# EAGLE design lighting_ctl (EAGLE 9.6.0)

## Sheet 1 of 2
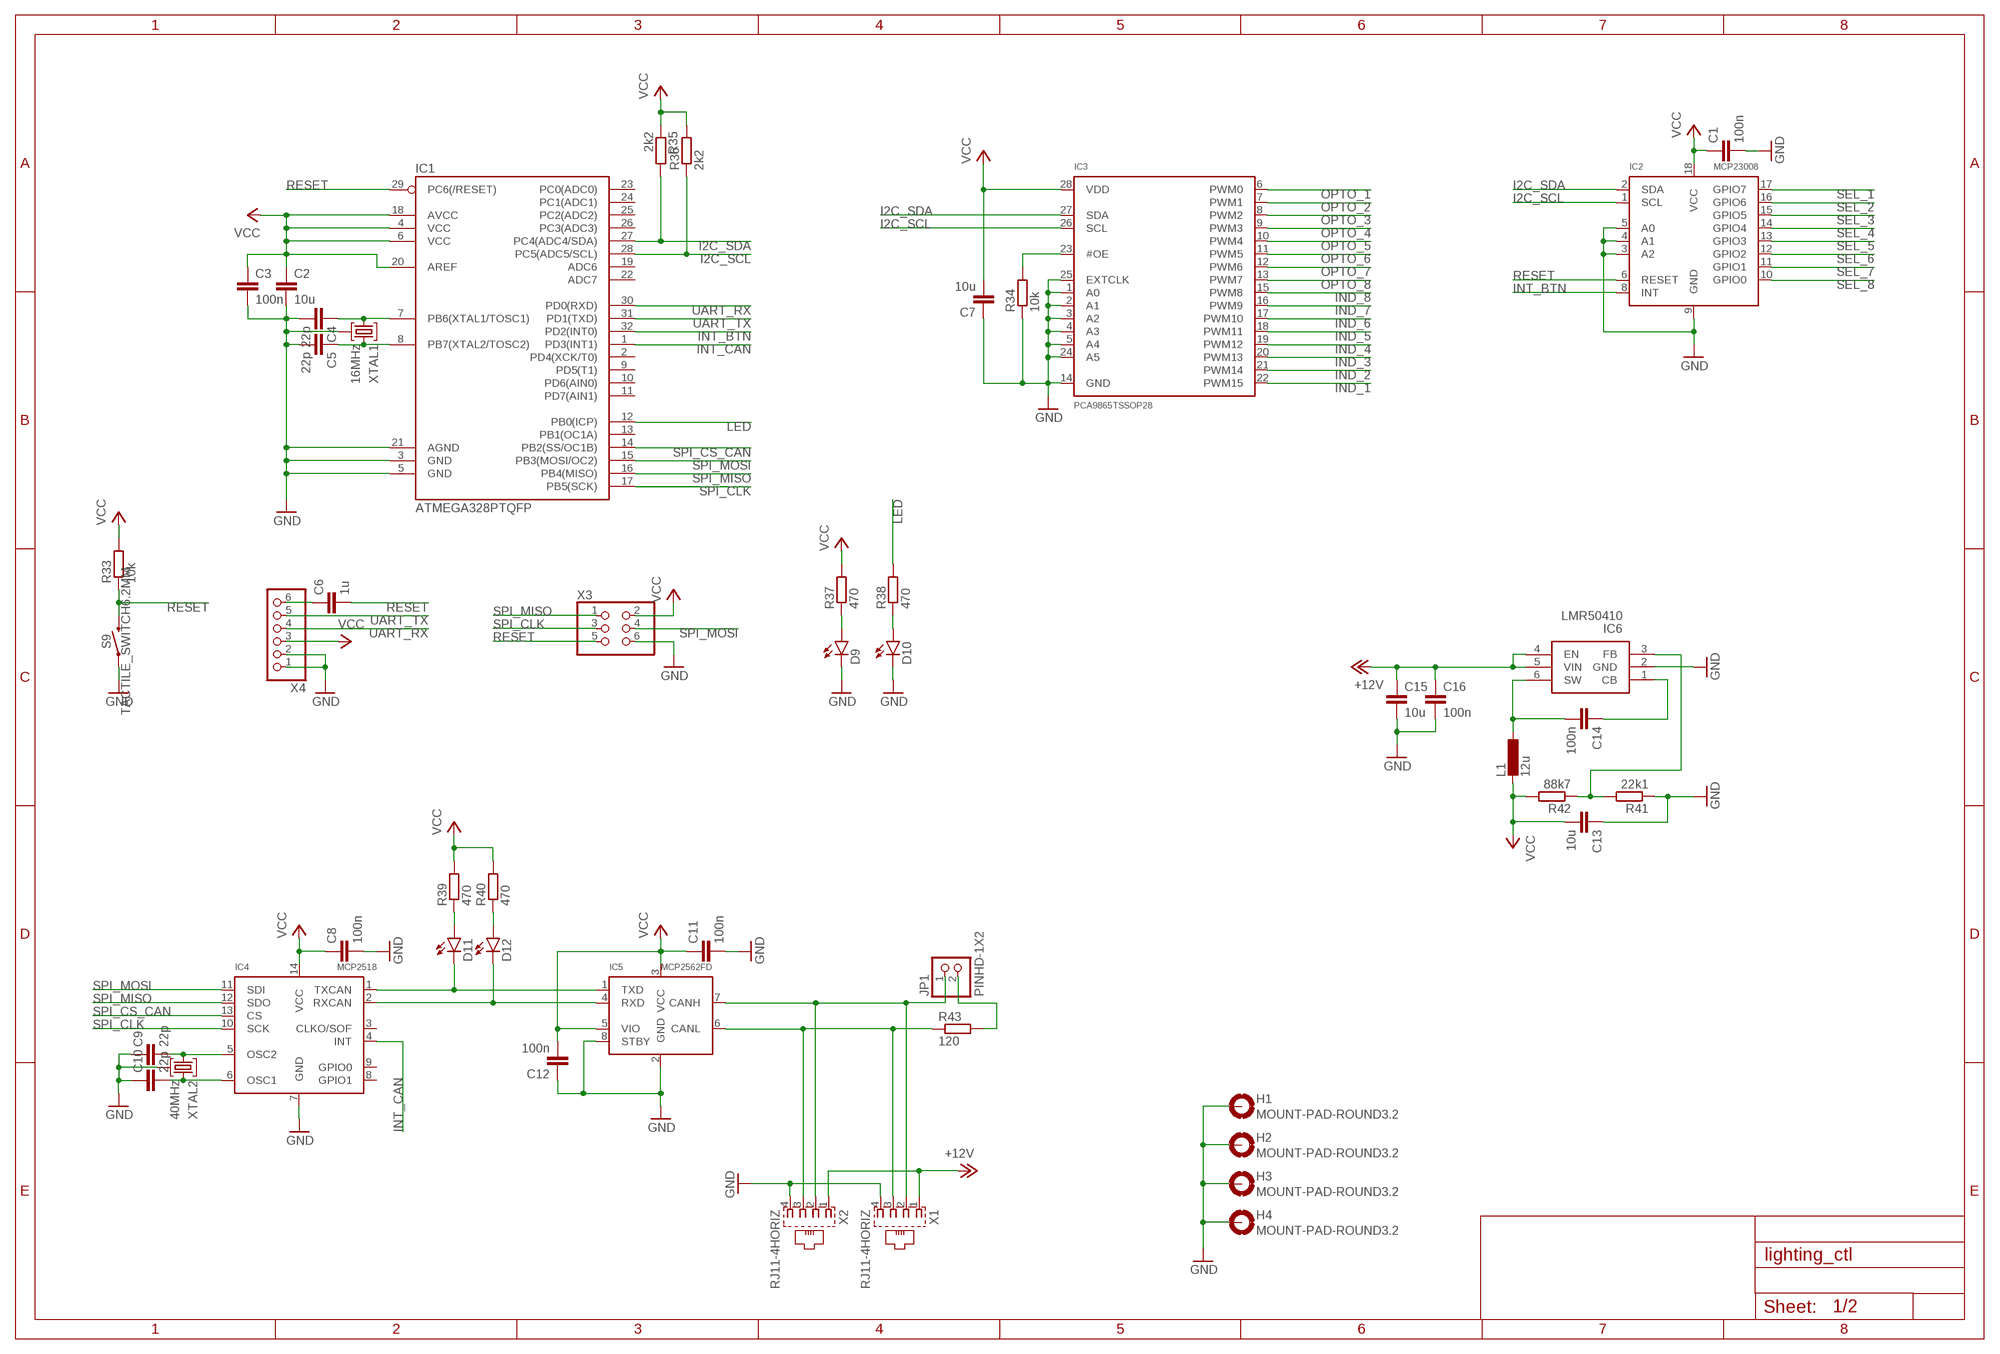
[diagram p0: schematic, sheet 1]

### Parts
C1  100n  CAPACITOR0805  [C0805]
C2  10u  CAPACITOR1206  [C1206]
C3  100n  CAPACITOR0805  [C0805]
C4  22p  CAPACITOR0805  [C0805]
C5  22p  CAPACITOR0805  [C0805]
C6  1u  CAPACITOR0805  [C0805]
C7  10u  CAPACITOR1206  [C1206]
C8  100n  CAPACITOR0805  [C0805]
C9  22p  CAPACITOR0805  [C0805]
C10  22p  CAPACITOR0805  [C0805]
C11  100n  CAPACITOR0805  [C0805]
C12  100n  CAPACITOR0805  [C0805]
C13  10u  CAPACITOR1206  [C1206]
C14  100n  CAPACITOR0805  [C0805]
C15  10u  CAPACITOR1206  [C1206]
C16  100n  CAPACITOR0805  [C0805]
D9  LED1206  [CHIPLED_1206]
D10  LED1206  [CHIPLED_1206]
D11  LED1206  [CHIPLED_1206]
D12  LED1206  [CHIPLED_1206]
H1  MOUNT-PAD-ROUND3.2  [3,2-PAD]
H2  MOUNT-PAD-ROUND3.2  [3,2-PAD]
H3  MOUNT-PAD-ROUND3.2  [3,2-PAD]
H4  MOUNT-PAD-ROUND3.2  [3,2-PAD]
IC1  ATMEGA328PTQFP  [TQFP32_0.8MM_7X7MM]
IC2  MCP23008  MCP23008SO18W  [SO18W]
IC3  PCA9865TSSOP28  [TSSOP28]
IC4  MCP2518  MCP2518FDSO14  [SO14]
IC5  MCP2562FD  MCP2562FDSO08  [SO08]
IC6  LMR50410  [SOT23-6]
JP1  PINHD-1X2  [1X02]
L1  12u  INDUCTOR7.3MM  [L_7.3MM]
R33  10k  RESISTOR0805  [R0805]
R34  10k  RESISTOR0805  [R0805]
R35  2k2  RESISTOR0805  [R0805]
R36  2k2  RESISTOR0805  [R0805]
R37  470  RESISTOR0805  [R0805]
R38  470  RESISTOR0805  [R0805]
R39  470  RESISTOR0805  [R0805]
R40  470  RESISTOR0805  [R0805]
R41  22k1  RESISTOR0805  [R0805]
R42  88k7  RESISTOR0805  [R0805]
R43  120  RESISTOR0805  [R0805]
S9  TACTILE_SWITCH6.2MM  [TACTILE_SWITCH_SMD_6.2MM]
X1  RJ11-4HORIZ  [RJ11-4_HORIZ]
X2  RJ11-4HORIZ  [RJ11-4_HORIZ]
X3  PINHD-2X3  [2X03]
X4  PINHD-1X6  [1X06]
XTAL1  16MHz  CRYSTAL_GND5X3.2  [XTAL_5.0X3.2_4]
XTAL2  40MHz  CRYSTAL_GND5X3.2  [XTAL_5.0X3.2_4]

### Nets
+12V: C15.1 C16.1 IC6.4(EN) IC6.5(VIN) X1.1 X2.1
GND: C1.2 C2.2 C3.2 C4.2 C5.2 C7.1 C8.2 C9.1 C10.1 C11.2 C12.1 C13.1 C15.2 C16.2 D9.C D10.C H1.B3,2(MOUNT) H1.P$1(MOUNT) H1.P$2(MOUNT) H1.P$3(MOUNT) H1.P$4(MOUNT) H1.P$5(MOUNT) H1.P$6(MOUNT) H1.P$7(MOUNT) H1.P$8(MOUNT) H2.B3,2(MOUNT) H2.P$1(MOUNT) H2.P$2(MOUNT) H2.P$3(MOUNT) H2.P$4(MOUNT) H2.P$5(MOUNT) H2.P$6(MOUNT) H2.P$7(MOUNT) H2.P$8(MOUNT) H3.B3,2(MOUNT) H3.P$1(MOUNT) H3.P$2(MOUNT) H3.P$3(MOUNT) H3.P$4(MOUNT) H3.P$5(MOUNT) H3.P$6(MOUNT) H3.P$7(MOUNT) H3.P$8(MOUNT) H4.B3,2(MOUNT) H4.P$1(MOUNT) H4.P$2(MOUNT) H4.P$3(MOUNT) H4.P$4(MOUNT) H4.P$5(MOUNT) H4.P$6(MOUNT) H4.P$7(MOUNT) H4.P$8(MOUNT) IC1.3(GND) IC1.5(GND) IC1.21(AGND) IC2.3(A2) IC2.4(A1) IC2.5(A0) IC2.9(GND) IC3.1(A0) IC3.2(A1) IC3.3(A2) IC3.4(A3) IC3.5(A4) IC3.14(GND) IC3.24(A5) IC3.25(EXTCLK) IC4.7(GND) IC5.2(GND) IC5.8(STBY) IC6.2(GND) R34.1 R41.1 S9.A1 S9.A2 X1.4 X2.4 X3.6 X4.1 X4.2 XTAL1.2 XTAL1.4 XTAL2.2 XTAL2.4 ; also sheet 2
I2C_SCL: IC1.28(PC5(ADC5/SCL)) IC2.1(SCL) IC3.26(SCL) R36.1
I2C_SDA: IC1.27(PC4(ADC4/SDA)) IC2.2(SDA) IC3.27(SDA) R35.2
IND_1: IC3.22(PWM15) ; also sheet 2
IND_2: IC3.21(PWM14) ; also sheet 2
IND_3: IC3.20(PWM13) ; also sheet 2
IND_4: IC3.19(PWM12) ; also sheet 2
IND_5: IC3.18(PWM11) ; also sheet 2
IND_6: IC3.17(PWM10) ; also sheet 2
IND_7: IC3.16(PWM9) ; also sheet 2
IND_8: IC3.15(PWM8) ; also sheet 2
INT_BTN: IC1.32(PD2(INT0)) IC2.8(INT)
INT_CAN: IC1.1(PD3(INT1)) IC4.4(INT)
LED: IC1.12(PB0(ICP)) R38.2
N$1: IC3.23(#OE) R34.2
N$2: D9.A R37.1
N$3: C4.1 IC1.7(PB6(XTAL1/TOSC1)) XTAL1.1
N$4: C5.1 IC1.8(PB7(XTAL2/TOSC2)) XTAL1.3
N$5: D10.A R38.1
N$6: C6.1 X4.6
N$7: C14.2 IC6.6(SW) L1.1
N$8: IC6.3(FB) R41.2 R42.1
N$9: C14.1 IC6.1(CB)
N$16: IC5.6(CANL) R43.1 X1.3 X2.3
N$17: IC5.7(CANH) JP1.1 X1.2 X2.2
N$18: D11.C IC4.1(TXCAN) IC5.1(TXD)
N$19: D12.C IC4.2(RXCAN) IC5.4(RXD)
N$20: C9.2 IC4.5(OSC2) XTAL2.1
N$21: C10.2 IC4.6(OSC1) XTAL2.3
N$22: D11.A R39.1
N$23: D12.A R40.1
N$24: JP1.2 R43.2
OPTO_1: IC3.6(PWM0) ; also sheet 2
OPTO_2: IC3.7(PWM1) ; also sheet 2
OPTO_3: IC3.8(PWM2) ; also sheet 2
OPTO_4: IC3.9(PWM3) ; also sheet 2
OPTO_5: IC3.10(PWM4) ; also sheet 2
OPTO_6: IC3.11(PWM5) ; also sheet 2
OPTO_7: IC3.12(PWM6) ; also sheet 2
OPTO_8: IC3.13(PWM7) ; also sheet 2
RESET: C6.2 IC1.29(PC6(/RESET)) IC2.6(RESET) R33.1 S9.B1 S9.B2 X3.5
SEL_1: IC2.17(GPIO7) ; also sheet 2
SEL_2: IC2.16(GPIO6) ; also sheet 2
SEL_3: IC2.15(GPIO5) ; also sheet 2
SEL_4: IC2.14(GPIO4) ; also sheet 2
SEL_5: IC2.13(GPIO3) ; also sheet 2
SEL_6: IC2.12(GPIO2) ; also sheet 2
SEL_7: IC2.11(GPIO1) ; also sheet 2
SEL_8: IC2.10(GPIO0) ; also sheet 2
SPI_CLK: IC1.17(PB5(SCK)) IC4.10(SCK) X3.3
SPI_CS_CAN: IC1.14(PB2(SS/OC1B)) IC4.13(CS)
SPI_MISO: IC1.16(PB4(MISO)) IC4.12(SDO) X3.1
SPI_MOSI: IC1.15(PB3(MOSI/OC2)) IC4.11(SDI) X3.4
UART_RX: IC1.30(PD0(RXD)) X4.4
UART_TX: IC1.31(PD1(TXD)) X4.5
VCC: C1.1 C2.1 C3.1 C7.2 C8.1 C11.1 C12.2 C13.2 IC1.4(VCC) IC1.6(VCC) IC1.18(AVCC) IC1.20(AREF) IC2.18(VCC) IC3.28(VDD) IC4.14(VCC) IC5.3(VCC) IC5.5(VIO) L1.2 R33.2 R35.1 R36.2 R37.2 R39.2 R40.2 R42.2 X3.2 X4.3
Unconnected: IC1.2(PD4(XCK/T0)) IC1.9(PD5(T1)) IC1.10(PD6(AIN0)) IC1.11(PD7(AIN1)) IC1.13(PB1(OC1A)) IC1.19(ADC6) IC1.22(ADC7) IC1.23(PC0(ADC0)) IC1.24(PC1(ADC1)) IC1.25(PC2(ADC2)) IC1.26(PC3(ADC3)) IC4.3(CLKO/SOF) IC4.8(GPIO1) IC4.9(GPIO0)

## Sheet 2 of 2
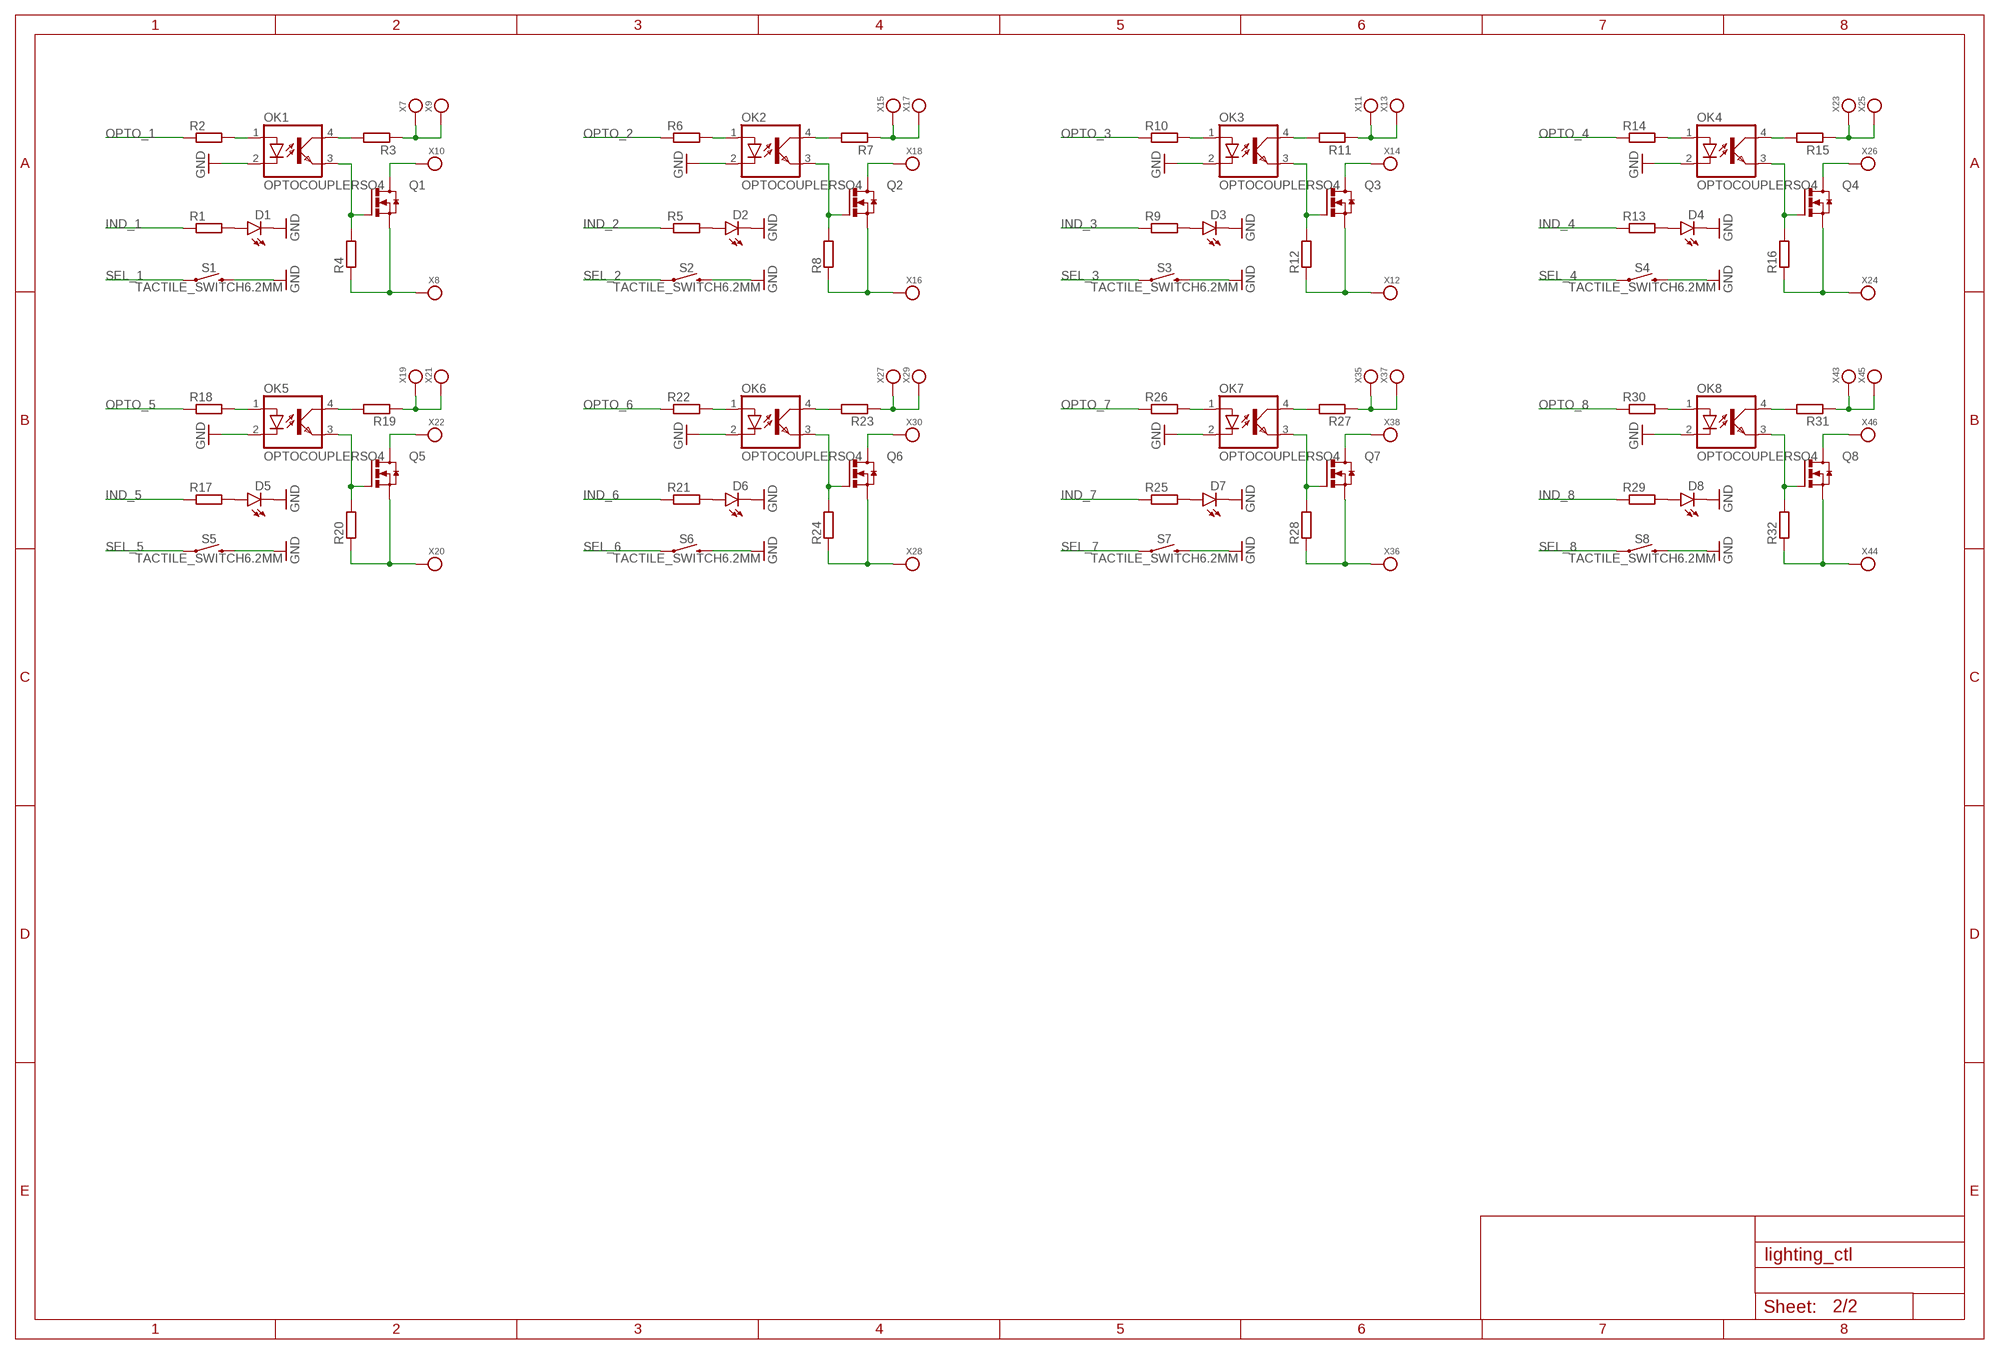
[diagram p1: schematic, sheet 2]

### Parts
D1  LED1206  [CHIPLED_1206]
D2  LED1206  [CHIPLED_1206]
D3  LED1206  [CHIPLED_1206]
D4  LED1206  [CHIPLED_1206]
D5  LED1206  [CHIPLED_1206]
D6  LED1206  [CHIPLED_1206]
D7  LED1206  [CHIPLED_1206]
D8  LED1206  [CHIPLED_1206]
OK1  OPTOCOUPLERSO4  [SO04]
OK2  OPTOCOUPLERSO4  [SO04]
OK3  OPTOCOUPLERSO4  [SO04]
OK4  OPTOCOUPLERSO4  [SO04]
OK5  OPTOCOUPLERSO4  [SO04]
OK6  OPTOCOUPLERSO4  [SO04]
OK7  OPTOCOUPLERSO4  [SO04]
OK8  OPTOCOUPLERSO4  [SO04]
Q1  MOSFET_N_CHANNELSOT223  [SOT223]
Q2  MOSFET_N_CHANNELSOT223  [SOT223]
Q3  MOSFET_N_CHANNELSOT223  [SOT223]
Q4  MOSFET_N_CHANNELSOT223  [SOT223]
Q5  MOSFET_N_CHANNELSOT223  [SOT223]
Q6  MOSFET_N_CHANNELSOT223  [SOT223]
Q7  MOSFET_N_CHANNELSOT223  [SOT223]
Q8  MOSFET_N_CHANNELSOT223  [SOT223]
R1  RESISTOR0805  [R0805]
R2  RESISTOR0805  [R0805]
R3  RESISTOR0805  [R0805]
R4  RESISTOR0805  [R0805]
R5  RESISTOR0805  [R0805]
R6  RESISTOR0805  [R0805]
R7  RESISTOR0805  [R0805]
R8  RESISTOR0805  [R0805]
R9  RESISTOR0805  [R0805]
R10  RESISTOR0805  [R0805]
R11  RESISTOR0805  [R0805]
R12  RESISTOR0805  [R0805]
R13  RESISTOR0805  [R0805]
R14  RESISTOR0805  [R0805]
R15  RESISTOR0805  [R0805]
R16  RESISTOR0805  [R0805]
R17  RESISTOR0805  [R0805]
R18  RESISTOR0805  [R0805]
R19  RESISTOR0805  [R0805]
R20  RESISTOR0805  [R0805]
R21  RESISTOR0805  [R0805]
R22  RESISTOR0805  [R0805]
R23  RESISTOR0805  [R0805]
R24  RESISTOR0805  [R0805]
R25  RESISTOR0805  [R0805]
R26  RESISTOR0805  [R0805]
R27  RESISTOR0805  [R0805]
R28  RESISTOR0805  [R0805]
R29  RESISTOR0805  [R0805]
R30  RESISTOR0805  [R0805]
R31  RESISTOR0805  [R0805]
R32  RESISTOR0805  [R0805]
S1  TACTILE_SWITCH6.2MM  [TACTILE_SWITCH_SMD_6.2MM]
S2  TACTILE_SWITCH6.2MM  [TACTILE_SWITCH_SMD_6.2MM]
S3  TACTILE_SWITCH6.2MM  [TACTILE_SWITCH_SMD_6.2MM]
S4  TACTILE_SWITCH6.2MM  [TACTILE_SWITCH_SMD_6.2MM]
S5  TACTILE_SWITCH6.2MM  [TACTILE_SWITCH_SMD_6.2MM]
S6  TACTILE_SWITCH6.2MM  [TACTILE_SWITCH_SMD_6.2MM]
S7  TACTILE_SWITCH6.2MM  [TACTILE_SWITCH_SMD_6.2MM]
S8  TACTILE_SWITCH6.2MM  [TACTILE_SWITCH_SMD_6.2MM]
X7  KEYSTONE_7788  [KEYSTONE_7788]
X8  KEYSTONE_7788  [KEYSTONE_7788]
X9  KEYSTONE_7788  [KEYSTONE_7788]
X10  KEYSTONE_7788  [KEYSTONE_7788]
X11  KEYSTONE_7788  [KEYSTONE_7788]
X12  KEYSTONE_7788  [KEYSTONE_7788]
X13  KEYSTONE_7788  [KEYSTONE_7788]
X14  KEYSTONE_7788  [KEYSTONE_7788]
X15  KEYSTONE_7788  [KEYSTONE_7788]
X16  KEYSTONE_7788  [KEYSTONE_7788]
X17  KEYSTONE_7788  [KEYSTONE_7788]
X18  KEYSTONE_7788  [KEYSTONE_7788]
X19  KEYSTONE_7788  [KEYSTONE_7788]
X20  KEYSTONE_7788  [KEYSTONE_7788]
X21  KEYSTONE_7788  [KEYSTONE_7788]
X22  KEYSTONE_7788  [KEYSTONE_7788]
X23  KEYSTONE_7788  [KEYSTONE_7788]
X24  KEYSTONE_7788  [KEYSTONE_7788]
X25  KEYSTONE_7788  [KEYSTONE_7788]
X26  KEYSTONE_7788  [KEYSTONE_7788]
X27  KEYSTONE_7788  [KEYSTONE_7788]
X28  KEYSTONE_7788  [KEYSTONE_7788]
X29  KEYSTONE_7788  [KEYSTONE_7788]
X30  KEYSTONE_7788  [KEYSTONE_7788]
X35  KEYSTONE_7788  [KEYSTONE_7788]
X36  KEYSTONE_7788  [KEYSTONE_7788]
X37  KEYSTONE_7788  [KEYSTONE_7788]
X38  KEYSTONE_7788  [KEYSTONE_7788]
X43  KEYSTONE_7788  [KEYSTONE_7788]
X44  KEYSTONE_7788  [KEYSTONE_7788]
X45  KEYSTONE_7788  [KEYSTONE_7788]
X46  KEYSTONE_7788  [KEYSTONE_7788]

### Nets
GND: D1.C D2.C D3.C D4.C D5.C D6.C D7.C D8.C OK1.2(C) OK2.2(C) OK3.2(C) OK4.2(C) OK5.2(C) OK6.2(C) OK7.2(C) OK8.2(C) S1.B1 S1.B2 S2.B1 S2.B2 S3.B1 S3.B2 S4.B1 S4.B2 S5.B1 S5.B2 S6.B1 S6.B2 S7.B1 S7.B2 S8.B1 S8.B2 ; also sheet 1
IND_1: R1.1 ; also sheet 1
IND_2: R5.1 ; also sheet 1
IND_3: R9.1 ; also sheet 1
IND_4: R13.1 ; also sheet 1
IND_5: R17.1 ; also sheet 1
IND_6: R21.1 ; also sheet 1
IND_7: R25.1 ; also sheet 1
IND_8: R29.1 ; also sheet 1
N$11: OK1.1(A) R2.2
N$12: D1.A R1.2
N$13: OK1.4(COL) R3.2
N$14: R3.1 X7.1(PIN) X7.2(PIN) X7.3(PIN) X7.4(PIN) X9.1(PIN) X9.2(PIN) X9.3(PIN) X9.4(PIN)
N$15: Q1.2(D) Q1.4(D) X10.1(PIN) X10.2(PIN) X10.3(PIN) X10.4(PIN)
N$25: OK1.3(EMIT) Q1.1(G) R4.2
N$26: Q1.3(S) R4.1 X8.1(PIN) X8.2(PIN) X8.3(PIN) X8.4(PIN)
N$27: OK3.1(A) R10.2
N$28: D3.A R9.2
N$29: OK3.4(COL) R11.2
N$30: R11.1 X11.1(PIN) X11.2(PIN) X11.3(PIN) X11.4(PIN) X13.1(PIN) X13.2(PIN) X13.3(PIN) X13.4(PIN)
N$31: Q3.2(D) Q3.4(D) X14.1(PIN) X14.2(PIN) X14.3(PIN) X14.4(PIN)
N$32: OK3.3(EMIT) Q3.1(G) R12.2
N$33: Q3.3(S) R12.1 X12.1(PIN) X12.2(PIN) X12.3(PIN) X12.4(PIN)
N$34: OK2.1(A) R6.2
N$35: D2.A R5.2
N$36: OK2.4(COL) R7.2
N$37: R7.1 X15.1(PIN) X15.2(PIN) X15.3(PIN) X15.4(PIN) X17.1(PIN) X17.2(PIN) X17.3(PIN) X17.4(PIN)
N$38: Q2.2(D) Q2.4(D) X18.1(PIN) X18.2(PIN) X18.3(PIN) X18.4(PIN)
N$39: OK2.3(EMIT) Q2.1(G) R8.2
N$40: Q2.3(S) R8.1 X16.1(PIN) X16.2(PIN) X16.3(PIN) X16.4(PIN)
N$41: OK5.1(A) R18.2
N$42: D5.A R17.2
N$43: OK5.4(COL) R19.2
N$44: R19.1 X19.1(PIN) X19.2(PIN) X19.3(PIN) X19.4(PIN) X21.1(PIN) X21.2(PIN) X21.3(PIN) X21.4(PIN)
N$45: Q5.2(D) Q5.4(D) X22.1(PIN) X22.2(PIN) X22.3(PIN) X22.4(PIN)
N$46: OK5.3(EMIT) Q5.1(G) R20.2
N$47: Q5.3(S) R20.1 X20.1(PIN) X20.2(PIN) X20.3(PIN) X20.4(PIN)
N$48: OK4.1(A) R14.2
N$49: D4.A R13.2
N$50: OK4.4(COL) R15.2
N$51: R15.1 X23.1(PIN) X23.2(PIN) X23.3(PIN) X23.4(PIN) X25.1(PIN) X25.2(PIN) X25.3(PIN) X25.4(PIN)
N$52: Q4.2(D) Q4.4(D) X26.1(PIN) X26.2(PIN) X26.3(PIN) X26.4(PIN)
N$53: OK4.3(EMIT) Q4.1(G) R16.2
N$54: Q4.3(S) R16.1 X24.1(PIN) X24.2(PIN) X24.3(PIN) X24.4(PIN)
N$55: OK6.1(A) R22.2
N$56: D6.A R21.2
N$57: OK6.4(COL) R23.2
N$58: R23.1 X27.1(PIN) X27.2(PIN) X27.3(PIN) X27.4(PIN) X29.1(PIN) X29.2(PIN) X29.3(PIN) X29.4(PIN)
N$59: Q6.2(D) Q6.4(D) X30.1(PIN) X30.2(PIN) X30.3(PIN) X30.4(PIN)
N$60: OK6.3(EMIT) Q6.1(G) R24.2
N$61: Q6.3(S) R24.1 X28.1(PIN) X28.2(PIN) X28.3(PIN) X28.4(PIN)
N$69: OK7.1(A) R26.2
N$70: D7.A R25.2
N$71: OK7.4(COL) R27.2
N$72: R27.1 X35.1(PIN) X35.2(PIN) X35.3(PIN) X35.4(PIN) X37.1(PIN) X37.2(PIN) X37.3(PIN) X37.4(PIN)
N$73: Q7.2(D) Q7.4(D) X38.1(PIN) X38.2(PIN) X38.3(PIN) X38.4(PIN)
N$74: OK7.3(EMIT) Q7.1(G) R28.2
N$75: Q7.3(S) R28.1 X36.1(PIN) X36.2(PIN) X36.3(PIN) X36.4(PIN)
N$83: OK8.1(A) R30.2
N$84: D8.A R29.2
N$85: OK8.4(COL) R31.2
N$86: R31.1 X43.1(PIN) X43.2(PIN) X43.3(PIN) X43.4(PIN) X45.1(PIN) X45.2(PIN) X45.3(PIN) X45.4(PIN)
N$87: Q8.2(D) Q8.4(D) X46.1(PIN) X46.2(PIN) X46.3(PIN) X46.4(PIN)
N$88: OK8.3(EMIT) Q8.1(G) R32.2
N$89: Q8.3(S) R32.1 X44.1(PIN) X44.2(PIN) X44.3(PIN) X44.4(PIN)
OPTO_1: R2.1 ; also sheet 1
OPTO_2: R6.1 ; also sheet 1
OPTO_3: R10.1 ; also sheet 1
OPTO_4: R14.1 ; also sheet 1
OPTO_5: R18.1 ; also sheet 1
OPTO_6: R22.1 ; also sheet 1
OPTO_7: R26.1 ; also sheet 1
OPTO_8: R30.1 ; also sheet 1
SEL_1: S1.A1 S1.A2 ; also sheet 1
SEL_2: S2.A1 S2.A2 ; also sheet 1
SEL_3: S3.A1 S3.A2 ; also sheet 1
SEL_4: S4.A1 S4.A2 ; also sheet 1
SEL_5: S5.A1 S5.A2 ; also sheet 1
SEL_6: S6.A1 S6.A2 ; also sheet 1
SEL_7: S7.A1 S7.A2 ; also sheet 1
SEL_8: S8.A1 S8.A2 ; also sheet 1

## Library data of the parts
C1-C16 = SMD:CAPACITOR
D1-D12 = SMD:LED
H1-H4 = THT:MOUNT-PAD-ROUND: MOUNTING PAD, round
IC1 = SMD:ATMEGA328P
IC2 = SMD:MCP23008
IC3 = SMD:PCA9865
IC4 = SMD:MCP2518FD
IC5 = SMD:MCP2562FD
IC6 = SMD:LMR50410
JP1 = THT:PINHD-1X2: PIN HEADER
L1 = SMD:INDUCTOR
OK1-OK8 = SMD:OPTOCOUPLER
Q1-Q8 = SMD:MOSFET_N_CHANNEL
R1-R43 = SMD:RESISTOR
S1-S9 = SMD:TACTILE_SWITCH
X1 X2 = THT:RJ11-4
X3 = THT:PINHD-2X3: PIN HEADER
X4 = THT:PINHD-1X6: PIN HEADER
X7-X30 X35-X38 X43-X46 = THT:KEYSTONE_7788
XTAL1 XTAL2 = SMD:CRYSTAL_GND

## Board
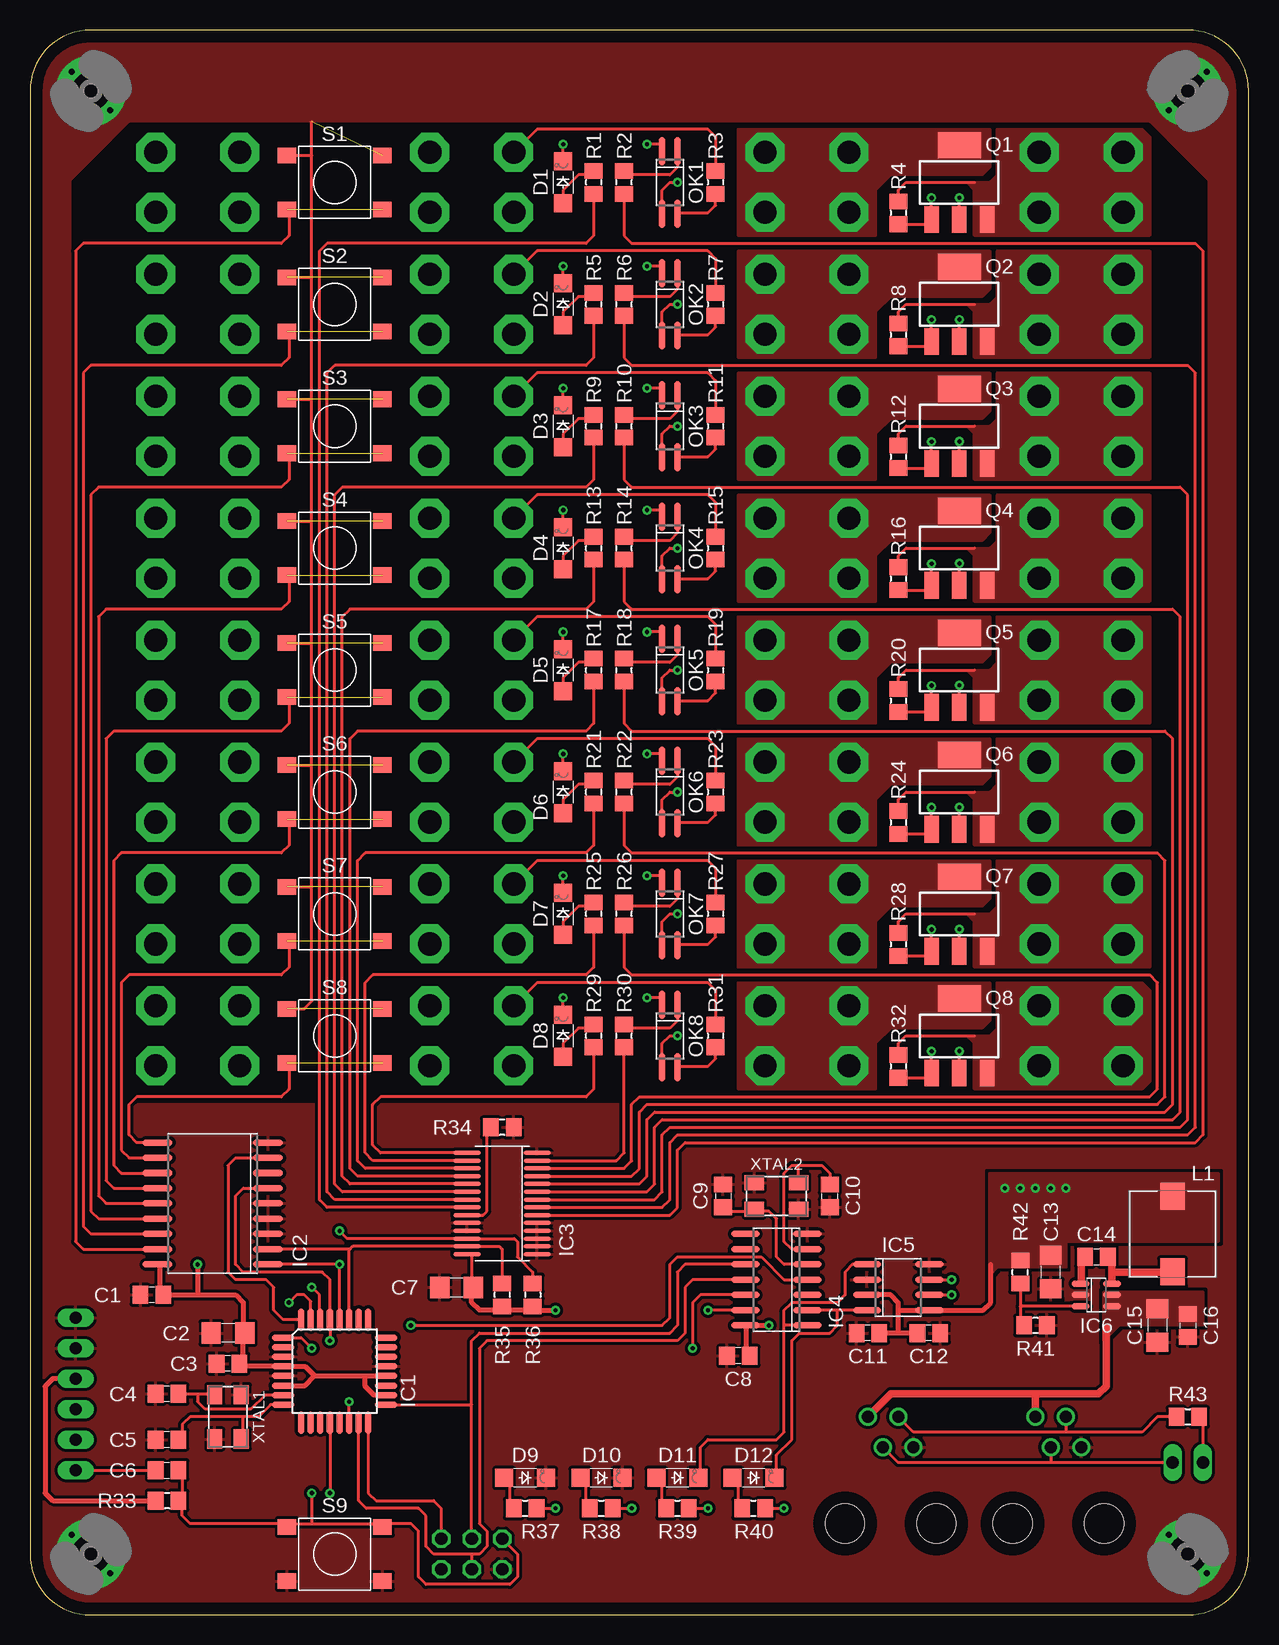
[diagram p2: board, top side]
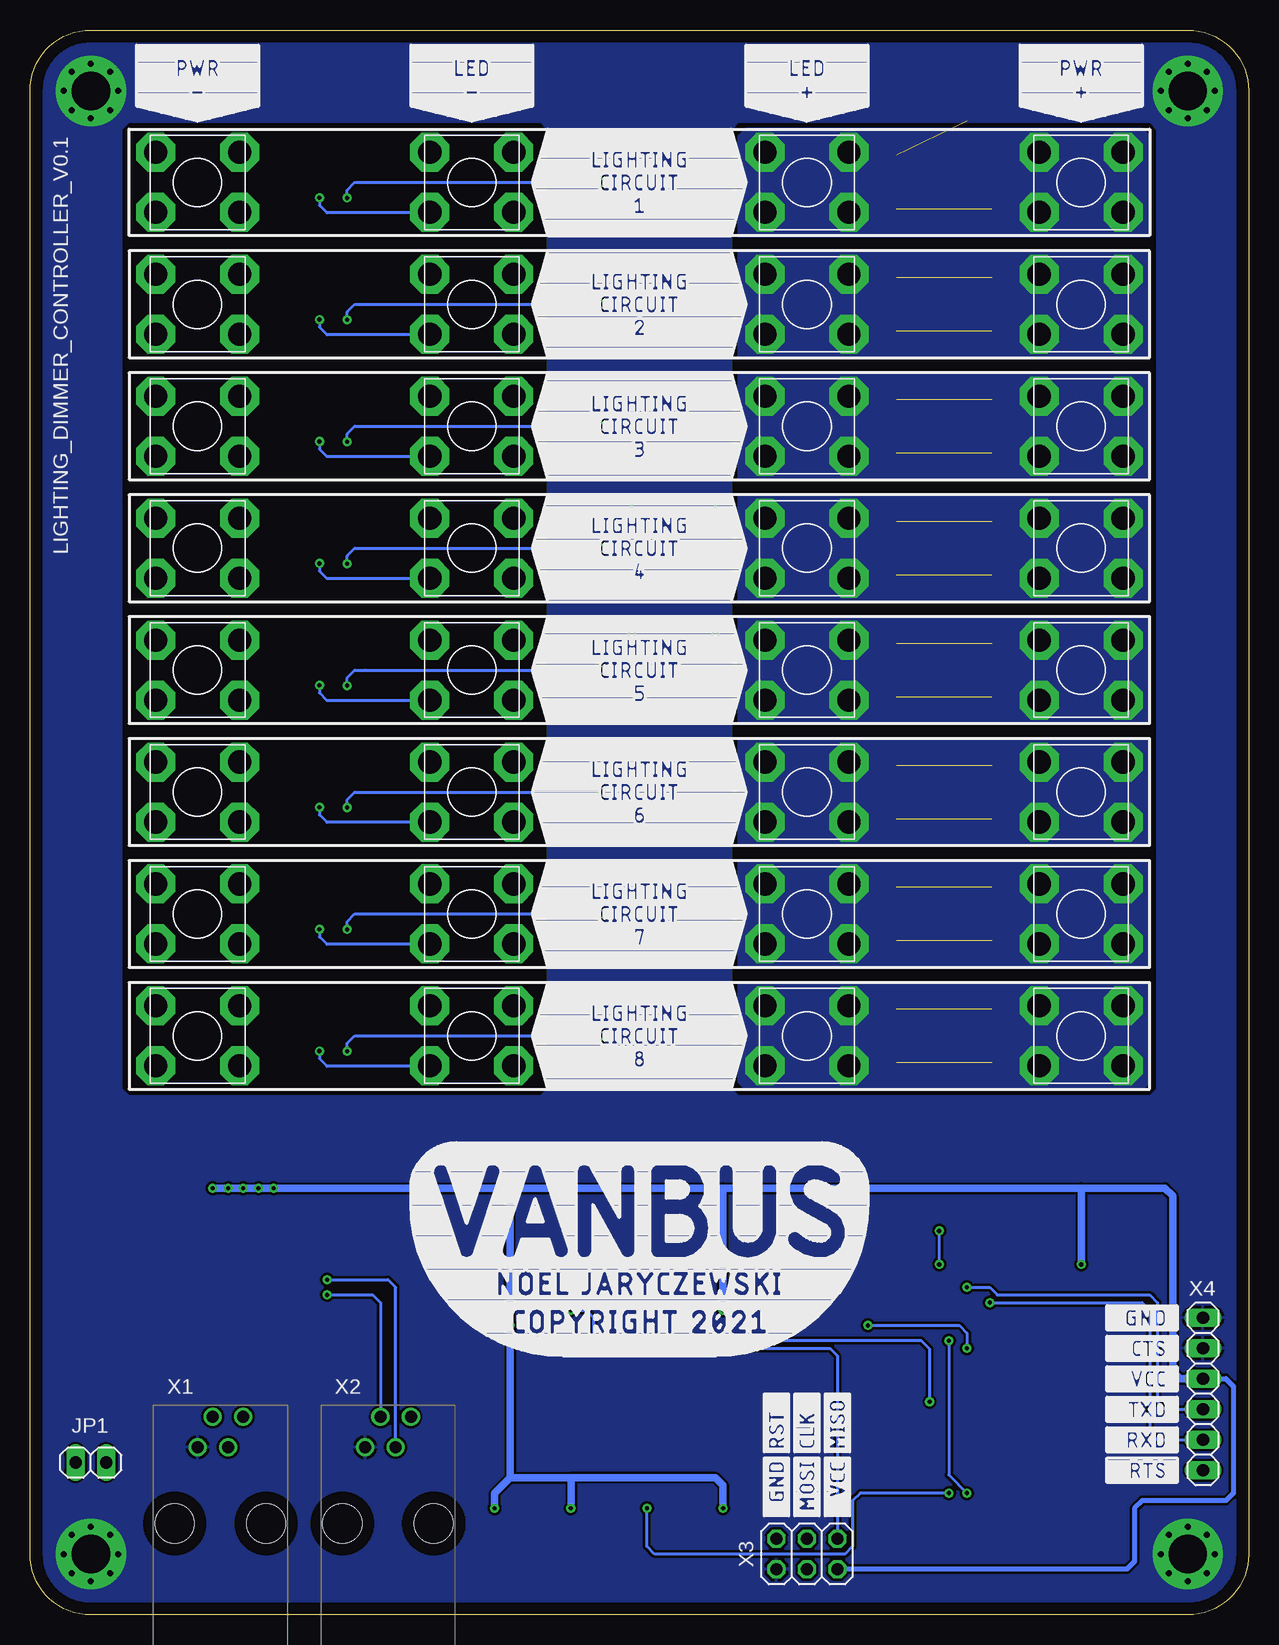
[diagram p3: board, bottom side, seen from below]

Size 101.6 x 132.08 mm. Coordinates in mm from the lower left corner, seen from the top.
Outline: 5.08,0 96.52,0 arc90 101.6,5.08 101.6,127 arc90 96.52,132.08 5.08,132.08 arc90 0,127 0,5.08 arc90 5.08,0
Copper layers (1*16): Top 0.035mm / dielectric 1.5mm / Bottom 0.035mm
Design rules "default *": minimum track width 6mil, minimum drill 0.35mm, track to track 8mil, track to pad 8mil, pad to pad 8mil, via to via 8mil, smd to smd 8mil, copper to edge 40mil, drill to drill 6mil, minimum pad ring 10mil, minimum via ring 8mil, stop-mask expansion 4mil, vias tented up to drill 16mil, thermal gap 10mil

### Footprints (pad centres in the part's own frame; a part is rotated, then mirrored left to right if it is on the bottom)
C0805 = smd 1.3 x 1.5: 1 -0.95,0; 2 0.95,0
C1206 = smd 1.6 x 1.8: 1 -1.4,0; 2 1.4,0
CHIPLED_1206 = smd 1.5 x 1.5: A 0,-1.75; C 0,1.75
3,2-PAD = drill 3.2 pad 5.842: B3,2 0,0 | drill 0.5: P$1 0,2.261; P$2 0,-2.261; P$3 2.261,0; P$4 -2.261,0; P$5 -1.598,1.598; P$6 1.598,1.598; P$7 -1.598,-1.598; P$8 1.598,-1.598
TQFP32_0.8MM_7X7MM = smd 1.905 x 0.559: 1 -4.293,2.8; 2 -4.293,2; 3 -4.293,1.2; 4 -4.293,0.4; 5 -4.293,-0.4; 6 -4.293,-1.2; 7 -4.293,-2; 8 -4.293,-2.8; 17 4.293,-2.8; 18 4.293,-2; 19 4.293,-1.2; 20 4.293,-0.4; 21 4.293,0.4; 22 4.293,1.2; 23 4.293,2; 24 4.293,2.8 | smd 0.559 x 1.905: 9 -2.8,-4.293; 10 -2,-4.293; 11 -1.2,-4.293; 12 -0.4,-4.293; 13 0.4,-4.293; 14 1.2,-4.293; 15 2,-4.293; 16 2.8,-4.293; 25 2.8,4.293; 26 2,4.293; 27 1.2,4.293; 28 0.4,4.293; 29 -0.4,4.293; 30 -1.2,4.293; 31 -2,4.293; 32 -2.8,4.293
SO18W = smd 0.559 x 2.515: 1 -5.08,-4.6; 2 -3.81,-4.6; 3 -2.54,-4.6; 4 -1.27,-4.6; 5 0,-4.6; 6 1.27,-4.6; 7 2.54,-4.6; 8 3.81,-4.6; 9 5.08,-4.6; 10 5.08,4.6; 11 3.81,4.6; 12 2.54,4.6; 13 1.27,4.6; 14 0,4.6; 15 -1.27,4.6; 16 -2.54,4.6; 17 -3.81,4.6; 18 -5.08,4.6
TSSOP28 = smd 0.356 x 2.261: 1 -4.225,-2.918; 2 -3.575,-2.918; 3 -2.925,-2.918; 4 -2.275,-2.918; 5 -1.625,-2.918; 6 -0.975,-2.918; 7 -0.325,-2.918; 8 0.325,-2.918; 9 0.975,-2.918; 10 1.625,-2.918; 11 2.275,-2.918; 12 2.925,-2.918; 13 3.575,-2.918; 14 4.225,-2.918; 15 4.225,2.918; 16 3.575,2.918; 17 2.925,2.918; 18 2.275,2.918; 19 1.625,2.918; 20 0.975,2.918; 21 0.325,2.918; 22 -0.325,2.918; 23 -0.975,2.918; 24 -1.625,2.918; 25 -2.275,2.918; 26 -2.925,2.918; 27 -3.575,2.918; 28 -4.225,2.918
SO14 = smd 0.559 x 2.388: 1 -3.81,-2.6; 2 -2.54,-2.6; 3 -1.27,-2.6; 4 0,-2.6; 5 1.27,-2.6; 6 2.54,-2.6; 7 3.81,-2.6; 8 3.81,2.6; 9 2.54,2.6; 10 1.27,2.6; 11 0,2.6; 12 -1.27,2.6; 13 -2.54,2.6; 14 -3.81,2.6
SO08 = smd 0.559 x 2.388: 1 -1.905,-2.6; 2 -0.635,-2.6; 3 0.635,-2.6; 4 1.905,-2.6; 5 1.905,2.6; 6 0.635,2.6; 7 -0.635,2.6; 8 -1.905,2.6
SOT23-6 = smd 0.559 x 1.524: 1 0.95,1.3; 2 0,1.3; 3 -0.95,1.3; 4 -0.95,-1.3; 5 0,-1.3; 6 0.95,-1.3
1X02 = drill 1.016 long: 1 -1.27,0; 2 1.27,0
L_7.3MM = smd 2.25 x 2.05: 1 -3.15,0; 2 3.15,0
SO04 = smd 0.559 x 2.388: 1 -0.635,-2.6; 2 0.635,-2.6; 3 0.635,2.6; 4 -0.635,2.6
SOT223 = smd 1.219 x 2.235: 1 -2.311,-3.099; 2 0,-3.099; 3 2.311,-3.099 | smd 3.6 x 2.2: 4 0,3.099
R0805 = smd 1.3 x 1.5: 1 -0.95,0; 2 0.95,0
TACTILE_SWITCH_SMD_6.2MM = smd 1.55 x 1.3: A1 -3.975,-2.25; A2 3.975,-2.25; B1 -3.975,2.25; B2 3.975,2.25
RJ11-4_HORIZ = drill 1: 1 -1.905,-8.89; 2 -0.635,-6.35; 3 0.635,-8.89; 4 1.905,-6.35 | hole 3.25: -3.81,0; 3.81,0
2X03 = drill 1.016 octagon: 1 -2.54,-1.27; 2 -2.54,1.27; 3 0,-1.27; 4 0,1.27; 5 2.54,-1.27; 6 2.54,1.27
1X06 = drill 1.016 long: 1 -6.35,0; 2 -3.81,0; 3 -1.27,0; 4 1.27,0; 5 3.81,0; 6 6.35,0
KEYSTONE_7788 = drill 1.93 pad 3.25 octagon: 1 -3.5,2.5; 2 -3.5,-2.5; 3 3.5,-2.5; 4 3.5,2.5
XTAL_5.0X3.2_4 = smd 1.6 x 1.25: 1 -1.85,-1.1; 2 1.85,-1.1; 3 1.85,1.1; 4 -1.85,1.1

### Placement (x,y rotation side)
C1  10.16,26.67 180 top
C2  16.51,23.5 180 top
C3  16.51,20.95 180 top
C4  11.43,18.41 180 top
C5  11.43,14.61 180 top
C6  11.43,12.06 0 top
C7  35.56,27.3 0 top
C8  59.05,21.59 180 top
C9  57.78,34.92 270 top
C10  66.67,34.92 90 top
C11  69.85,23.5 180 top
C12  74.93,23.5 180 top
C13  85.09,28.57 90 top
C14  88.9,29.84 0 top
C15  93.98,24.13 270 top
C16  96.52,24.13 270 top
D1  44.45,119.38 0 top
D2  44.45,109.22 0 top
D3  44.45,99.06 0 top
D4  44.45,88.9 0 top
D5  44.45,78.74 0 top
D6  44.45,68.58 0 top
D7  44.45,58.42 0 top
D8  44.45,48.26 0 top
D9  41.27,11.43 270 top
D10  47.62,11.43 270 top
D11  53.98,11.43 270 top
D12  60.33,11.43 270 top
H1  5.08,5.08 0 top
H2  96.52,5.08 0 top
H3  96.52,127 90 top
H4  5.08,127 0 top
IC1  25.4,20.32 0 top
IC2  15.24,34.29 90 top
IC3  39.37,34.29 90 top
IC4  62.23,27.94 90 top
IC5  72.39,27.3 270 top
IC6  88.9,26.67 90 top
JP1  96.52,12.7 180 bottom
L1  95.25,31.75 90 top
OK1  53.34,119.38 180 top
OK2  53.34,109.22 180 top
OK3  53.34,99.06 180 top
OK4  53.34,88.9 180 top
OK5  53.34,78.74 180 top
OK6  53.34,68.58 180 top
OK7  53.34,58.42 180 top
OK8  53.34,48.26 180 top
Q1  77.47,119.38 0 top
Q2  77.47,109.22 0 top
Q3  77.47,99.06 0 top
Q4  77.47,88.9 0 top
Q5  77.47,78.74 0 top
Q6  77.47,68.58 0 top
Q7  77.47,58.42 0 top
Q8  77.47,48.26 0 top
R1  46.99,119.38 90 top
R2  49.53,119.38 90 top
R3  57.15,119.38 270 top
R4  72.39,116.84 270 top
R5  46.99,109.22 90 top
R6  49.53,109.22 90 top
R7  57.15,109.22 270 top
R8  72.39,106.68 270 top
R9  46.99,99.06 90 top
R10  49.53,99.06 90 top
R11  57.15,99.06 270 top
R12  72.39,96.52 270 top
R13  46.99,88.9 90 top
R14  49.53,88.9 90 top
R15  57.15,88.9 270 top
R16  72.39,86.36 270 top
R17  46.99,78.74 90 top
R18  49.53,78.74 90 top
R19  57.15,78.74 270 top
R20  72.39,76.2 270 top
R21  46.99,68.58 90 top
R22  49.53,68.58 90 top
R23  57.15,68.58 270 top
R24  72.39,66.04 270 top
R25  46.99,58.42 90 top
R26  49.53,58.42 90 top
R27  57.15,58.42 270 top
R28  72.39,55.88 270 top
R29  46.99,48.26 90 top
R30  49.53,48.26 90 top
R31  57.15,48.26 270 top
R32  72.39,45.72 270 top
R33  11.43,9.53 180 top
R34  39.37,40.64 180 top
R35  39.37,26.67 90 top
R36  41.91,26.67 270 top
R37  41.27,8.89 0 top
R38  47.62,8.89 0 top
R39  53.98,8.89 0 top
R40  60.33,8.89 0 top
R41  83.82,24.13 180 top
R42  82.55,28.57 90 top
R43  96.52,16.51 0 top
S1  25.4,119.38 0 top
S2  25.4,109.22 0 top
S3  25.4,99.06 0 top
S4  25.4,88.9 0 top
S5  25.4,78.74 0 top
S6  25.4,68.58 0 top
S7  25.4,58.42 0 top
S8  25.4,48.26 0 top
S9  25.4,5.08 0 top
X1  85.72,7.62 180 bottom
X2  71.75,7.62 180 bottom
X3  36.83,5.08 180 bottom
X4  3.81,18.41 270 bottom
X7  13.97,119.38 0 bottom
X8  87.63,119.38 180 bottom
X9  36.83,119.38 0 bottom
X10  64.77,119.38 0 bottom
X11  13.97,99.06 0 bottom
X12  87.63,99.06 180 bottom
X13  36.83,99.06 0 bottom
X14  64.77,99.06 0 bottom
X15  13.97,109.22 0 bottom
X16  87.63,109.22 180 bottom
X17  36.83,109.22 0 bottom
X18  64.77,109.22 0 bottom
X19  13.97,78.74 0 bottom
X20  87.63,78.74 180 bottom
X21  36.83,78.74 0 bottom
X22  64.77,78.74 0 bottom
X23  13.97,88.9 0 bottom
X24  87.63,88.9 180 bottom
X25  36.83,88.9 0 bottom
X26  64.77,88.9 0 bottom
X27  13.97,68.58 0 bottom
X28  87.63,68.58 180 bottom
X29  36.83,68.58 0 bottom
X30  64.77,68.58 0 bottom
X35  13.97,58.42 0 bottom
X36  87.63,58.42 180 bottom
X37  36.83,58.42 0 bottom
X38  64.77,58.42 0 bottom
X43  13.97,48.26 0 bottom
X44  87.63,48.26 180 bottom
X45  36.83,48.26 0 bottom
X46  64.77,48.26 0 bottom
XTAL1  16.51,16.51 270 top
XTAL2  62.23,34.92 0 top

### Tracks (layer width: path | path; a pad name or v marks a point on that pad's centre or on a via)
+12V
  Top 0.61: 83.82,18.41 71.75,18.41 X2.1 | 83.82,18.41 89.08,18.41 89.71,19.05 89.71,23.95 | X1.1 83.82,18.41
  pour Top (no thermals): 89.53,26.92 97.79,26.92 97.79,24.13 90.81,24.13 89.53,22.86
GND  (via drill 0.35)  (8 unrouted)
  Top 0.254: D1.C v44.45,122.56 | OK1.2 52.7,122.56 v51.44,122.56 | D2.C v44.45,112.39 | OK2.2 52.7,112.39 v51.44,112.39 | D3.C v44.45,102.23 | OK3.2 52.7,102.23 v51.44,102.23 | D4.C v44.45,92.08 | OK4.2 52.7,92.08 v51.44,92.08 | D5.C v44.45,81.92 | OK5.2 52.7,81.92 v51.44,81.92 | D6.C v44.45,71.75 | OK6.2 52.7,71.75 v51.44,71.75 | D7.C v44.45,61.59 | OK7.2 52.7,61.59 v51.44,61.59 | D8.C v44.45,51.44 | OK8.2 52.7,51.44 v51.44,51.44 | S8.B1 22.86,50.51 23.5,51.15 23.5,60.67 | 23.5,60.67 23.5,70.83 | 23.5,70.83 23.5,80.99 | 23.5,80.99 23.5,91.15 | 23.5,91.15 23.5,101.31 | 23.5,101.31 23.5,111.47 | 23.5,111.47 23.5,121.63 | 23.5,121.63 23.5,124.46 | S1.B1 23.5,121.63 | S2.B1 23.5,111.47 | S3.B1 23.5,101.31 | S4.B1 23.5,91.15 | S5.B1 23.5,80.99 | S6.B1 23.5,70.83 | S7.B1 23.5,60.67
  pour Top (isolate 0.254, rank 2): 95.89,0.64 5.71,0.64 arc-90 0.64,5.71 0.64,42.55 100.97,42.55 100.97,5.71 arc-90
  pour Top (isolate 0.254): 0.64,42.55 0.64,126.36 arc-90 5.71,131.44 95.89,131.44 arc-90 100.97,126.36 100.97,42.55 98.3,42.55 98.3,119.51 93.34,124.46 8.26,124.46 3.3,119.51 3.3,42.55
  pour Bottom (isolate 0.254): 0.64,43.81 0.64,126.36 arc-90 5.71,131.44 95.89,131.44 arc-90 100.97,126.36 100.97,43.81 93.98,43.81 93.98,123.83 93.34,124.46 59.05,124.46 58.42,123.83 58.42,43.18 43.18,43.18 43.18,123.83 42.55,124.46 8.26,124.46 7.62,123.83 7.62,43.81
  pour Bottom: 7.62,43.81 8.26,43.18 42.55,43.18 43.18,43.81 58.42,43.81 59.05,43.18 93.34,43.18 93.98,43.81 100.97,43.81 100.97,5.71 arc-90 95.89,0.64 5.71,0.64 arc-90 0.64,5.71 0.64,43.81
  pour Top (no thermals): 88.9,27.05 86.36,27.05 86.36,26.29 88.9,26.29
I2C_SCL  (via drill 0.35)
  Top 0.254: IC1.28 v25.8,29.21 IC2.1 | R36.1 41.91,28.57 40.64,29.84 40.64,31.11 40.39,31.36 IC3.26 26.43,31.36 v25.8,32
  Bottom 0.254: v25.8,29.21 v25.8,32
I2C_SDA
  Top 0.254: IC1.27 26.6,30.41 | IC2.2 26.6,30.48 26.6,30.41 | 26.6,30.41 26.91,30.71 IC3.27 39.13,30.71 39.37,30.48 R35.2
IND_1
  Top 0.254: R1.1 46.99,114.94 46.35,114.3 24.77,114.3 24.13,113.67 24.13,34.6 24.77,33.97 IC3.22
IND_2
  Top 0.254: R5.1 46.99,104.78 46.35,104.14 25.4,104.14 24.77,103.5 24.77,35.25 25.4,34.62 IC3.21
IND_3
  Top 0.254: R9.1 46.99,94.61 46.35,93.98 26.04,93.98 25.4,93.34 25.4,35.9 26.04,35.27 IC3.20
IND_4
  Top 0.254: R13.1 46.99,84.45 46.35,83.82 26.67,83.82 26.04,83.19 26.04,36.55 26.67,35.91 IC3.19
IND_5
  Top 0.254: R17.1 46.99,74.3 46.35,73.66 27.3,73.66 26.67,73.03 26.67,37.2 27.3,36.56 IC3.18
IND_6
  Top 0.254: R21.1 46.99,64.14 46.35,63.5 27.94,63.5 27.3,62.87 27.3,37.85 27.94,37.22 IC3.17
IND_7
  Top 0.254: R25.1 46.99,53.98 46.35,53.34 28.57,53.34 27.94,52.7 27.94,38.5 28.57,37.87 IC3.16
IND_8
  Top 0.254: R29.1 46.99,43.81 46.35,43.18 29.21,43.18 28.57,42.55 28.57,39.15 29.21,38.52 IC3.15
INT_BTN
  Top 0.254: IC2.8 17.14,38.1 16.51,37.47 16.51,28.57 17.14,27.94 19.68,27.94 20.32,27.3 20.32,25.4 21.11,24.61 IC1.32
INT_CAN  (via drill 0.35)
  Top 0.254: v31.75,24.13 52.7,24.13 53.34,24.77 53.34,29.21 53.98,29.84 60.96,29.84 62.87,27.94 IC4.4 | IC1.1 22.6,23.12 v23.5,22.23
  Bottom 0.254: v31.75,24.13 24.13,24.13 23.5,23.5 v23.5,22.23
LED  (via drill 0.35)
  Top 0.254: IC1.12 v25,10.16 | R38.2 v50.16,8.89
  Bottom 0.254: v25,10.16 32.38,10.16 33.02,9.53 33.02,5.71 33.66,5.08 49.53,5.08 50.16,5.71 v50.16,8.89
N$1
  Top 0.254: IC3.23 37.76,33.31 38.1,33.66 38.1,40.32 R34.2
N$2
  Top 0.254: R37.1 40.01,9.21 40.01,10.95 D9.A
N$3
  Top 0.254: IC1.7 19.59,18.32 18.41,17.14 14.61,17.14 13.97,17.78 13.97,18.41 | 13.97,18.41 15.36,18.41 XTAL1.1 | C4.1 13.97,18.41
N$4
  Top 0.254: IC1.8 20.06,17.52 19.05,16.51 17.78,16.51 | 17.78,16.51 13.34,16.51 12.7,15.88 12.7,14.93 C5.1 | XTAL1.3 17.61,15.07 17.78,15.24 17.78,16.51
N$5
  Top 0.254: R38.1 46.35,9.21 46.35,10.95 D10.A
N$6
  Top 0.254: X4.6 C6.1
N$7
  Top 0.254: 90.17,27.65 IC6.6
  Top 0.61: C14.2 90.2,29.5 90.2,29.24 90.17,29.21 90.17,28.57 | L1.1 95.22,28.57 90.17,28.57 | 90.17,28.57 90.17,27.65
N$8
  Top 0.254: IC6.3 82.55,25.72 | R42.1 82.55,25.72 | 82.55,25.72 82.55,24.13 R41.2
N$9
  Top 0.254: 87.63,27.65 IC6.1
  Top 0.61: C14.1 87.95,29.53 87.63,29.21 87.63,27.65
N$11
  Top 0.254: OK1.1 53.98,120.65 53.34,120.02 49.84,120.02 R2.2
N$12
  Top 0.254: R1.2 46.67,120.02 45.72,120.02 44.45,118.75 D1.A
N$13
  Top 0.254: OK1.4 54.03,116.84 56.52,116.84 57.15,117.47 R3.2
N$14
  Top 0.254: R3.1 57.15,123.19 56.52,123.83 42.27,123.83 X9.1
  pour Bottom (isolate 0.254, no thermals): 8.89,123.83 41.91,123.83 42.55,123.19 42.55,114.94 8.26,114.94 8.26,123.19
N$15  (via drill 0.35)
  Top 0.254: Q1.2 v77.47,118.11
  Bottom 0.254: v77.47,118.11 77.47,117.47 76.83,116.84 68.31,116.84 X10.2
  pour Top (isolate 0.254, no thermals): 59.05,123.83 80.01,123.83 80.01,120.65 79.38,120.02 71.75,120.02 70.48,118.75 70.48,114.94 59.05,114.94
N$16  (via drill 0.35)
  Top 0.254: R43.1 93.98,16.51 92.71,15.24 86.36,15.24 | 86.36,15.24 73.66,15.24 X2.3 | IC5.6 v76.83,26.67 | X1.3 86.36,15.24
  Bottom 0.254: v76.83,26.67 73.03,26.67 72.39,26.04 X2.3
N$17  (via drill 0.35)
  Top 0.254: IC5.7 v76.83,27.94 | X2.2 72.39,12.7 85.09,12.7 | JP1.1 85.09,12.7 | X1.2 85.09,12.7
  Bottom 0.254: v76.83,27.94 71.75,27.94 71.12,27.3 X2.2
N$18
  Top 0.254: IC5.1 68.58,29.21 67.94,28.57 67.94,26.67 67.31,26.04 63.5,26.04 62.87,25.4 62.87,24.13 | IC4.1 62.87,24.13 | 62.87,24.13 62.87,15.24 62.23,14.61 56.52,14.61 55.88,13.97 55.88,12.06 55.73,11.91 D11.C
N$19
  Top 0.254: IC5.4 67.31,25.4 | 67.31,25.4 IC4.2 | 67.31,25.4 67.31,24.13 66.67,23.5 64.14,23.5 63.5,22.86 63.5,14.61 62.23,13.34 62.23,12.06 62.08,11.91 D12.C
N$20
  Top 0.254: IC4.5 62.87,29.21 62.23,29.84 62.23,33.02 61.59,33.66 60.55,33.66 60.44,33.77 | 60.44,33.77 XTAL2.1 60.38,33.71 | C9.2 58.1,33.98 58.42,33.66 60.33,33.66 60.38,33.71 | 60.38,33.71 60.44,33.77
N$21
  Top 0.254: IC4.6 63.5,30.48 62.87,31.11 62.87,36.83 63.5,37.47 64.14,37.47 | 64.14,37.47 66.04,37.47 66.67,36.83 C10.2 | XTAL2.3 64.08,37.41 64.14,37.47
N$22
  Top 0.254: R39.1 52.7,9.21 52.7,10.95 D11.A
N$23
  Top 0.254: R40.1 59.05,9.21 59.05,10.95 D12.A
N$24
  Top 0.254: JP1.2 97.79,16.19 R43.2
N$25  (via drill 0.35)
  Top 0.254: R4.2 74.77,115.89 Q1.1 v75.16,118.09 | OK1.3 52.7,118.75 53.34,119.38 v53.98,119.38
  Bottom 0.254: v53.98,119.38 74.52,119.38 75.16,118.75 v75.16,118.09
N$26
  Top 0.254: R4.1 72.39,118.75 73.03,119.38 78.74,119.38
  pour Top (isolate 0.254, no thermals): 93.34,123.19 93.34,114.94 78.74,114.94 78.74,118.75 78.11,119.38 80.01,119.38 80.64,120.02 80.64,123.83 92.71,123.83
N$27
  Top 0.254: OK3.1 53.98,100.33 53.34,99.69 49.84,99.69 R10.2
N$28
  Top 0.254: R9.2 46.67,99.69 45.72,99.69 44.45,98.42 D3.A
N$29
  Top 0.254: OK3.4 54.03,96.52 56.52,96.52 57.15,97.16 R11.2
N$30
  Top 0.254: R11.1 57.15,102.87 56.52,103.5 42.27,103.5 X13.1
  pour Bottom (isolate 0.254, no thermals): 8.26,103.5 42.55,103.5 42.55,94.61 8.26,94.61
N$31  (via drill 0.35)
  Top 0.254: Q3.2 v77.47,97.79
  Bottom 0.254: v77.47,97.79 77.47,97.16 76.83,96.52 68.31,96.52 X14.2
  pour Top (isolate 0.254, no thermals): 59.05,103.5 80.01,103.5 80.01,100.33 79.38,99.69 71.75,99.69 70.48,98.42 70.48,94.61 59.05,94.61
N$32  (via drill 0.35)
  Top 0.254: R12.2 74.77,95.57 Q3.1 v75.16,97.77 | OK3.3 52.7,98.42 53.34,99.06 v53.98,99.06
  Bottom 0.254: v53.98,99.06 74.52,99.06 75.16,98.42 v75.16,97.77
N$33
  Top 0.254: R12.1 72.39,98.42 73.03,99.06 78.74,99.06
  pour Top (isolate 0.254, no thermals): 93.34,103.5 93.34,94.61 78.74,94.61 78.74,98.42 78.11,99.06 80.01,99.06 80.64,99.69 80.64,103.5
N$34
  Top 0.254: OK2.1 53.98,110.49 53.34,109.86 49.84,109.86 R6.2
N$35
  Top 0.254: R5.2 46.67,109.86 45.72,109.86 44.45,108.58 D2.A
N$36
  Top 0.254: OK2.4 54.03,106.68 56.52,106.68 57.15,107.31 R7.2
N$37
  Top 0.254: R7.1 57.15,113.03 56.52,113.67 42.27,113.67 X17.1
  pour Bottom (isolate 0.254, no thermals): 8.26,113.67 42.55,113.67 42.55,104.78 8.26,104.78
N$38  (via drill 0.35)
  Top 0.254: Q2.2 v77.47,107.95
  Bottom 0.254: v77.47,107.95 77.47,107.31 76.83,106.68 68.31,106.68 X18.2
  pour Top (isolate 0.254, no thermals): 59.05,113.67 80.01,113.67 80.01,110.49 79.38,109.86 71.75,109.86 70.48,108.58 70.48,104.78 59.05,104.78
N$39  (via drill 0.35)
  Top 0.254: R8.2 74.77,105.73 Q2.1 v75.16,107.93 | OK2.3 52.7,108.58 53.34,109.22 v53.98,109.22
  Bottom 0.254: v53.98,109.22 74.52,109.22 75.16,108.58 v75.16,107.93
N$40
  Top 0.254: R8.1 72.39,108.58 73.03,109.22 78.74,109.22
  pour Top (isolate 0.254, no thermals): 93.34,113.67 93.34,104.78 78.74,104.78 78.74,108.58 78.11,109.22 80.01,109.22 80.64,109.86 80.64,113.67
N$41
  Top 0.254: OK5.1 53.98,80.01 53.34,79.38 49.84,79.38 R18.2
N$42
  Top 0.254: R17.2 46.67,79.38 45.72,79.38 44.45,78.11 D5.A
N$43
  Top 0.254: OK5.4 54.03,76.2 56.52,76.2 57.15,76.83 R19.2
N$44
  Top 0.254: R19.1 57.15,82.55 56.52,83.19 42.27,83.19 X21.1
  pour Bottom (isolate 0.254, no thermals): 8.26,83.19 42.55,83.19 42.55,74.3 8.26,74.3
N$45  (via drill 0.35)
  Top 0.254: Q5.2 v77.47,77.47
  Bottom 0.254: v77.47,77.47 77.47,76.83 76.83,76.2 68.58,76.2 68.54,76.24 X22.2
  pour Top (isolate 0.254, no thermals): 59.05,83.19 80.01,83.19 80.01,80.01 79.38,79.38 71.75,79.38 70.48,78.11 70.48,74.3 59.05,74.3
N$46  (via drill 0.35)
  Top 0.254: R20.2 74.77,75.25 Q5.1 v75.16,77.45 | OK5.3 52.7,78.11 53.34,78.74 v53.98,78.74
  Bottom 0.254: v53.98,78.74 73.66,78.74 74.52,78.74 75.16,78.11 v75.16,77.45
N$47
  Top 0.254: R20.1 72.39,78.11 73.03,78.74 78.74,78.74
  pour Top (isolate 0.254, no thermals): 93.34,83.19 93.34,74.3 78.74,74.3 78.74,78.11 78.11,78.74 80.01,78.74 80.64,79.38 80.64,83.19
N$48
  Top 0.254: OK4.1 53.98,90.17 53.34,89.53 49.84,89.53 R14.2
N$49
  Top 0.254: R13.2 46.67,89.53 45.72,89.53 44.45,88.27 D4.A
N$50
  Top 0.254: OK4.4 54.03,86.36 56.52,86.36 57.15,87 R15.2
N$51
  Top 0.254: R15.1 57.15,92.71 56.52,93.34 42.27,93.34 X25.1
  pour Bottom (isolate 0.254, no thermals): 8.26,93.34 42.55,93.34 42.55,84.45 8.26,84.45
N$52  (via drill 0.35)
  Top 0.254: Q4.2 v77.47,87.63
  Bottom 0.254: v77.47,87.63 77.47,87 76.83,86.36 68.58,86.36 68.54,86.4 X26.2
  pour Top (isolate 0.254, no thermals): 59.05,93.34 80.01,93.34 80.01,90.17 79.38,89.53 71.75,89.53 70.48,88.27 70.48,84.45 59.05,84.45
N$53  (via drill 0.35)
  Top 0.254: R16.2 74.77,85.41 Q4.1 v75.16,87.61 | OK4.3 52.7,88.27 53.34,88.9 v53.98,88.9
  Bottom 0.254: v53.98,88.9 74.52,88.9 75.16,88.27 v75.16,87.61
N$54
  Top 0.254: R16.1 72.39,88.27 73.03,88.9 78.74,88.9
  pour Top (isolate 0.254, no thermals): 93.34,93.34 93.34,84.45 78.74,84.45 78.74,88.27 78.11,88.9 80.01,88.9 80.64,89.53 80.64,93.34
N$55
  Top 0.254: OK6.1 53.98,69.85 53.34,69.22 49.84,69.22 R22.2
N$56
  Top 0.254: R21.2 46.67,69.22 45.72,69.22 44.45,67.94 D6.A
N$57
  Top 0.254: OK6.4 54.03,66.04 56.52,66.04 57.15,66.67 R23.2
N$58
  Top 0.254: R23.1 57.15,72.39 56.52,73.03 42.27,73.03 X29.1
  pour Bottom (isolate 0.254, no thermals): 8.26,73.03 42.55,73.03 42.55,64.14 8.26,64.14
N$59  (via drill 0.35)
  Top 0.254: Q6.2 v77.47,67.31
  Bottom 0.254: v77.47,67.31 77.47,66.67 76.83,66.04 68.58,66.04 68.54,66.08 X30.2
  pour Top (isolate 0.254, no thermals): 59.05,73.03 80.01,73.03 80.01,69.85 79.38,69.22 71.75,69.22 70.48,67.94 70.48,64.14 59.05,64.14
N$60  (via drill 0.35)
  Top 0.254: R24.2 74.77,65.09 Q6.1 v75.16,67.29 | OK6.3 52.7,67.94 53.34,68.58 v53.98,68.58
  Bottom 0.254: v53.98,68.58 74.52,68.58 75.16,67.94 v75.16,67.29
N$61
  Top 0.254: R24.1 72.39,67.94 73.03,68.58 78.74,68.58
  pour Top (isolate 0.254, no thermals): 93.34,73.03 93.34,64.14 78.74,64.14 78.74,67.94 78.11,68.58 80.01,68.58 80.64,69.22 80.64,73.03
N$69
  Top 0.254: OK7.1 53.98,59.69 53.34,59.05 49.84,59.05 R26.2
N$70
  Top 0.254: R25.2 46.67,59.05 45.72,59.05 44.45,57.78 D7.A
N$71
  Top 0.254: OK7.4 54.03,55.88 56.52,55.88 57.15,56.52 R27.2
N$72
  Top 0.254: R27.1 57.15,62.23 56.52,62.87 42.27,62.87 X37.1
  pour Bottom (isolate 0.254, no thermals): 8.26,62.87 42.55,62.87 42.55,53.98 8.26,53.98
N$73  (via drill 0.35)
  Top 0.254: Q7.2 v77.47,57.15
  Bottom 0.254: v77.47,57.15 77.47,56.52 76.83,55.88 68.58,55.88 68.54,55.92 X38.2
  pour Top (isolate 0.254, no thermals): 59.05,62.87 80.01,62.87 80.01,59.69 79.38,59.05 71.75,59.05 70.48,57.78 70.48,53.98 59.05,53.98
N$74  (via drill 0.35)
  Top 0.254: R28.2 74.77,54.93 Q7.1 v75.16,57.13 | OK7.3 52.7,57.78 53.34,58.42 v53.98,58.42
  Bottom 0.254: v53.98,58.42 74.52,58.42 75.16,57.78 v75.16,57.13
N$75
  Top 0.254: R28.1 72.39,57.78 73.03,58.42 78.74,58.42
  pour Top (isolate 0.254, no thermals): 93.34,62.87 93.34,53.98 78.74,53.98 78.74,57.78 78.11,58.42 80.01,58.42 80.64,59.05 80.64,62.87
N$83
  Top 0.254: OK8.1 53.98,49.53 53.34,48.9 49.84,48.9 R30.2
N$84
  Top 0.254: R29.2 46.67,48.9 45.72,48.9 44.45,47.62 D8.A
N$85
  Top 0.254: OK8.4 54.03,45.72 56.52,45.72 57.15,46.35 R31.2
N$86
  Top 0.254: R31.1 57.15,52.07 56.52,52.7 42.27,52.7 X45.1
  pour Bottom (isolate 0.254, no thermals): 8.26,52.7 42.55,52.7 42.55,44.45 41.91,43.81 8.89,43.81 8.26,44.45
N$87  (via drill 0.35)
  Top 0.254: Q8.2 v77.47,46.99
  Bottom 0.254: v77.47,46.99 77.47,46.35 76.83,45.72 68.58,45.72 68.54,45.76 X46.2
  pour Top (isolate 0.254, no thermals): 59.05,52.7 80.01,52.7 80.01,49.53 79.38,48.9 71.75,48.9 70.48,47.62 70.48,43.81 59.05,43.81
N$88  (via drill 0.35)
  Top 0.254: R32.2 74.77,44.77 Q8.1 v75.16,46.97 | OK8.3 52.7,47.62 53.34,48.26 v53.98,48.26
  Bottom 0.254: v53.98,48.26 74.52,48.26 75.16,47.62 v75.16,46.97
N$89
  Top 0.254: R32.1 72.39,47.62 73.03,48.26 78.74,48.26
  pour Top (isolate 0.254, no thermals): 92.71,52.7 93.34,52.07 93.34,44.45 92.71,43.81 78.74,43.81 78.74,47.62 78.11,48.26 80.01,48.26 80.64,48.9 80.64,52.7
OPTO_1
  Top 0.254: R2.1 49.53,114.94 50.16,114.3 97.16,114.3 97.79,113.67 97.79,40.01 97.16,39.37 54.61,39.37 53.98,38.73 53.98,33.95 53.34,33.31 IC3.6
OPTO_2
  Top 0.254: R6.1 49.53,104.78 50.16,104.14 96.52,104.14 97.16,103.5 97.16,40.64 96.52,40.01 53.98,40.01 53.34,39.37 53.34,34.6 52.7,33.97 IC3.7
OPTO_3
  Top 0.254: R10.1 49.53,94.61 50.16,93.98 95.89,93.98 96.52,93.34 96.52,41.27 95.89,40.64 53.34,40.64 52.7,40.01 52.7,35.25 52.07,34.62 IC3.8
OPTO_4
  Top 0.254: R14.1 49.53,84.45 50.16,83.82 95.25,83.82 95.89,83.19 95.89,41.91 95.25,41.27 52.7,41.27 52.07,40.64 52.07,35.9 51.44,35.27 IC3.9
OPTO_5
  Top 0.254: R18.1 49.53,74.3 50.16,73.66 94.61,73.66 95.25,73.03 95.25,42.55 94.61,41.91 52.07,41.91 51.44,41.27 51.44,36.55 50.8,35.91 IC3.10
OPTO_6
  Top 0.254: R22.1 49.53,64.14 50.16,63.5 93.98,63.5 94.61,62.87 94.61,43.18 93.98,42.55 51.44,42.55 50.8,41.91 50.8,37.2 50.16,36.56 IC3.11
OPTO_7
  Top 0.254: R26.1 49.53,53.98 50.16,53.34 93.34,53.34 93.98,52.7 93.98,43.81 93.34,43.18 50.8,43.18 50.16,42.55 50.16,37.85 49.53,37.22 IC3.12
OPTO_8
  Top 0.254: IC3.13 48.9,37.87 49.53,38.5 R30.1
RESET  (via drill 0.35)
  Top 0.254: IC2.6 17.78,35.56 17.14,34.92 17.14,29.21 17.78,28.57 24.36,28.57 25,27.94 IC1.29 v25,22.86 | C6.2 12.7,11.74 12.7,9.85 12.54,9.69 | 12.54,9.69 R33.1 | 12.54,9.69 12.7,9.53 12.7,8.26 13.34,7.62 21.14,7.62 S9.B1 21.71,7.62 23.5,7.62 | X3.5 40.64,5.08 40.64,3.17 40.01,2.54 33.02,2.54 32.38,3.17 32.38,6.99 31.75,7.62 29.84,7.62 29.55,7.33 S9.B2 29.09,7.62 23.5,7.62 | v23.5,10.16 23.5,7.62
  Bottom 0.254: v25,22.86 25,11.66 v23.5,10.16
SEL_1  (1 unrouted)
  Top 0.254: S1.A1 21.59,116.97 21.59,114.94 20.95,114.3 4.45,114.3 3.81,113.67 3.81,31.11 4.45,30.48 IC2.17
SEL_2  (1 unrouted)
  Top 0.254: S2.A1 21.59,106.81 21.59,104.78 20.95,104.14 5.08,104.14 4.45,103.5 4.45,32.38 5.08,31.75 IC2.16
SEL_3  (1 unrouted)
  Top 0.254: S3.A1 21.59,96.64 21.59,94.61 20.95,93.98 5.71,93.98 5.08,93.34 5.08,33.66 5.71,33.02 IC2.15
SEL_4  (1 unrouted)
  Top 0.254: S4.A1 21.59,86.48 21.59,84.45 20.95,83.82 6.35,83.82 5.71,83.19 5.71,34.92 6.35,34.29 IC2.14
SEL_5  (1 unrouted)
  Top 0.254: S5.A1 21.59,76.33 21.59,74.3 20.95,73.66 6.99,73.66 6.35,73.03 6.35,36.2 6.99,35.56 IC2.13
SEL_6  (1 unrouted)
  Top 0.254: S6.A1 21.59,66.17 21.59,64.14 20.95,63.5 7.62,63.5 6.99,62.87 6.99,37.47 7.62,36.83 IC2.12
SEL_7  (1 unrouted)
  Top 0.254: S7.A1 21.59,56.01 21.59,53.98 20.95,53.34 8.26,53.34 7.62,52.7 7.62,38.73 8.26,38.1 IC2.11
SEL_8  (1 unrouted)
  Top 0.254: S8.A1 21.59,45.84 21.59,43.81 20.95,43.18 8.89,43.18 8.26,42.55 8.26,40.01 8.89,39.37 IC2.10
SPI_CLK
  Top 0.254: IC4.10 54.61,29.21 53.98,28.57 53.98,24.13 53.34,23.5 37.47,23.5 36.83,22.86 36.83,17.52 | IC1.17 36.83,17.52 | X3.3 36.83,17.52
SPI_CS_CAN  (via drill 0.35)
  Top 0.254: IC4.13 v56.52,25.4 | IC1.14 v26.6,17.78
  Bottom 0.254: v56.52,25.4 55.24,25.4 54.61,24.77 54.61,23.5 53.98,22.86 27.3,22.86 26.6,22.16 v26.6,17.78
SPI_MISO  (via drill 0.35)
  Top 0.254: X3.1 34.29,8.89 33.66,9.53 28.84,9.53 28.2,10.16 IC1.16 | v55.24,22.23 55.24,26.04 55.88,26.67 IC4.12
  Bottom 0.254: v55.24,22.23 34.92,22.23 34.29,21.59 X3.1
SPI_MOSI
  Top 0.254: 36.83,5.08 33.66,5.08 33.02,5.71 33.02,8.26 32.38,8.89 28.04,8.89 27.4,9.53 IC1.15 | IC4.11 55.24,27.94 54.61,27.3 54.61,23.5 53.98,22.86 38.1,22.86 37.47,22.23 37.47,7.62 38.1,6.99 38.1,5.71 37.47,5.08 36.83,5.08 | 36.83,5.08 X3.4
UART_RX  (via drill 0.35)
  Top 0.254: IC1.30 24.13,24.68 24.13,26.67 v23.5,27.3
  Bottom 0.254: v23.5,27.3 21.59,27.3 20.95,26.67 8.26,26.67 7.62,26.04 7.62,17.78 6.99,17.14 X4.4
UART_TX  (via drill 0.35)
  Top 0.254: IC1.31 23.4,26.13 22.86,26.67 22.23,26.67 v21.59,26.04
  Bottom 0.254: v21.59,26.04 8.89,26.04 8.26,25.4 8.26,15.24 7.62,14.61 X4.5
VCC  (via drill 0.35)
  Top 0.254: C11.1 71.12,23.5 | C12.2 73.34,23.5 | IC4.14 59.69,24.07 | 59.69,21.91 C8.1 | 41.75,25.56 41.59,25.4 | 39.37,25.4 R35.1 39.05,25.4 | C7.2 36.9,27.37 | 36.9,27.37 36.83,27.43 36.83,30.07 IC3.28 | 36.83,27.3 36.9,27.37 | R37.2 v43.81,8.89 | R39.2 v56.52,8.89 | R40.2 v62.87,8.89
  Top 0.406: 17.78,23.5 C2.1 | 17.78,23.5 17.78,21.27 C3.1 17.46,20.72 IC1.4 22.93,20.72 23.73,19.92 | 23.73,19.92 27.94,19.92 | 27.94,19.92 IC1.20 | IC1.6 22.93,19.12 23.73,19.92 | IC1.18 28.67,18.32 27.94,19.05 27.94,19.92 | 73.34,23.5 72.39,23.5 | 72.39,23.5 71.12,23.5 | 72.39,23.5 72.39,25.4 | 72.39,25.4 IC5.5 79.45,25.4 80.09,26.04 80.09,29.21 | 59.69,24.07 59.69,21.91 | IC2.18 10.79,29.05 10.79,26.98 C1.1 13.97,26.67 | 13.97,26.67 17.14,26.67 17.78,26.04 17.78,23.5 | 41.59,25.4 39.37,25.4 | 39.05,25.4 37.47,25.4 36.83,26.04 36.83,27.3 | 72.39,25.4 72.39,26.04 71.75,26.67 IC5.3 | X4.3 1.91,19.68 1.27,19.05 1.27,10.16 1.91,9.53 R33.2 | v13.97,29.21 13.97,26.67 | 41.75,25.56 R36.2 42.23,25.72 42.55,25.4 v43.81,25.4 | IC4.14 v61.59,24.13
  Bottom 0.406: X4.3 1.91,19.68 1.27,19.05 1.27,10.16 1.91,9.53 8.89,9.53 9.53,8.89 9.53,4.45 10.16,3.81 X3.2
  Bottom 0.61: v86.36,35.56 61.59,35.56 | 61.59,35.56 43.81,35.56 | 43.81,35.56 13.97,35.56 | 13.97,35.56 v13.97,29.21 | 61.59,35.56 v61.59,24.13 61.59,11.43 | 13.97,35.56 6.99,35.56 6.35,34.92 6.35,20.32 5.71,19.68 X4.3 | v43.81,25.4 43.81,35.56 | 61.59,11.43 62.87,10.16 v62.87,8.89 | 61.59,11.43 56.52,11.43 | 56.52,11.43 44.45,11.43 43.81,10.79 v43.81,8.89 | 56.52,11.43 v56.52,8.89
  other vias: 82.55,35.56 81.28,35.56 83.82,35.56 85.09,35.56
  pour Top (no thermals): 80.01,28.32 80.01,36.83 99.06,36.83 99.06,31.11 86.36,31.11 86.36,28.96 80.64,28.96

### Text on the board
bPlace: LIGHTING_DIMMER_CONTROLLER_V0.1